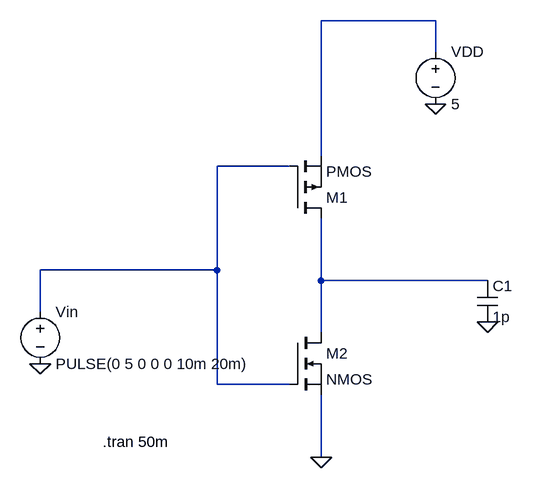
[diagram p0: schematic INV_shcematic.asc]
INV_shcematic.asc, the LTspice schematic file:
Version 4
SHEET 1 880 680
WIRE 304 -304 128 -304
WIRE 304 -256 304 -304
WIRE 128 -96 128 -304
WIRE 80 -80 -32 -80
WIRE -32 80 -32 -80
WIRE -32 80 -304 80
WIRE 128 96 128 0
WIRE 384 96 128 96
WIRE -304 144 -304 80
WIRE 128 176 128 96
WIRE -32 256 -32 80
WIRE 80 256 -32 256
WIRE 128 368 128 272
FLAG 304 -176 0
FLAG -304 224 0
FLAG 128 368 0
FLAG 384 160 0
SYMBOL voltage 304 -272 R0
WINDOW 123 0 0 Left 0
WINDOW 39 0 0 Left 0
SYMATTR InstName VDD
SYMATTR Value 5
SYMBOL voltage -304 128 R0
WINDOW 123 0 0 Left 0
WINDOW 39 0 0 Left 0
SYMATTR InstName Vin
SYMATTR Value PULSE(0 5 0 0 0 10m 20m)
SYMBOL pmos 80 0 M180
SYMATTR InstName M1
SYMBOL nmos 80 176 R0
SYMATTR InstName M2
SYMBOL cap 368 96 R0
SYMATTR InstName C1
SYMATTR Value 1p
TEXT -208 344 Left 2 !.tran 50m

The netlist it stands for:
* INV_shcematic.asc
VDD N001 0 5
Vin N002 0 PULSE(0 5 0 0 0 10m 20m)
M1 N003 N002 N001 N001 PMOS
M2 N003 N002 0 0 NMOS
C1 N003 0 1p
.model NMOS NMOS
.model PMOS PMOS
.lib standard.mos
.tran 50m
.backanno
.end